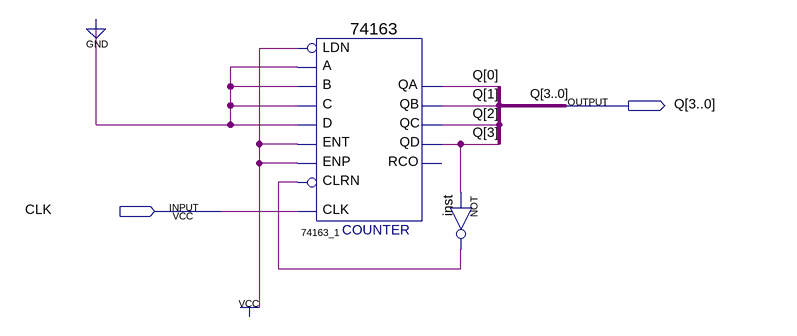
[diagram p0: schematic sheet]
// Quartus schematic SpecialCount.bdf as structural Verilog: 2 symbols, 2 pins
module SpecialCount (
  input  CLK,
  output [3:0] Q
);

  wire inst_out;

  \74163  u_74163_1 (
    .C(1'b0), .B(1'b0), .A(1'b0), .ENT(1'b1), .D(1'b0), .CLRN(inst_out), .CLK(CLK), .ENP(1'b1), .LDN(1'b1),
    .QA(Q[0]), .QB(Q[1]), .QC(Q[2]), .QD(Q[3]));  // open: RCO
  not inst (inst_out, Q[3]);
endmodule
